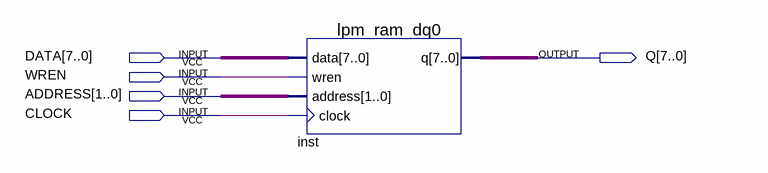
[diagram p0: schematic sheet]
// Quartus schematic DQ.bdf as structural Verilog: 1 symbols, 5 pins
module DQ (
  input  [7:0] DATA,
  input  WREN,
  input  [1:0] ADDRESS,
  input  CLOCK,
  output [7:0] Q
);

  lpm_ram_dq0 inst (.data(DATA), .wren(WREN), .address(ADDRESS), .clock(CLOCK), .q(Q));
endmodule
